# EAGLE design Grove - Buzzer v1.1b (EAGLE 6.3)
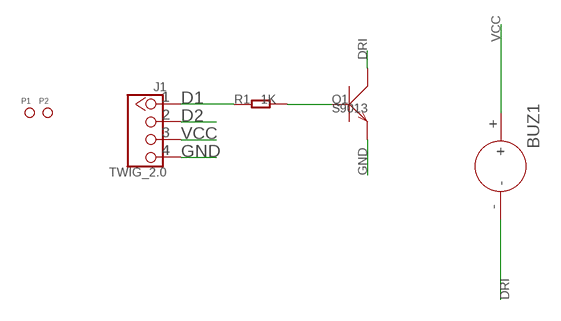
[diagram p0: schematic, sheet 1]

## Parts
BUZ1  BUZZER-YMD12065  [2P-7.6-D12X6.5H]
J1  TWIG_2.0  [2.0_1X4]
P1  PAD-MARK  [ROUND-MARK-1.0]
P2  PAD-MARK  [ROUND-MARK-1.0]
Q1  S9013  TRANSISTOR-NPN-SOT23  [SOT23]
R1  1K  R-0603  [R0603]

## Nets
D1: J1.1 R1.1
D2: J1.2
DRI: BUZ1.- Q1.3(C)
GND: J1.4 Q1.2(E)
N$2: Q1.1(B) R1.2
VCC: BUZ1.+ J1.3

## Library data of the parts
BUZ1 = Discrete:BUZZER
J1 = CONNECTER:TWIG_2.0
P1 P2 = Discrete:PAD-MARK; PARTNO: DNP
Q1 = Discrete:TRANSISTOR-NPN*: NPN audion
R1 = Discrete:R*

## Board
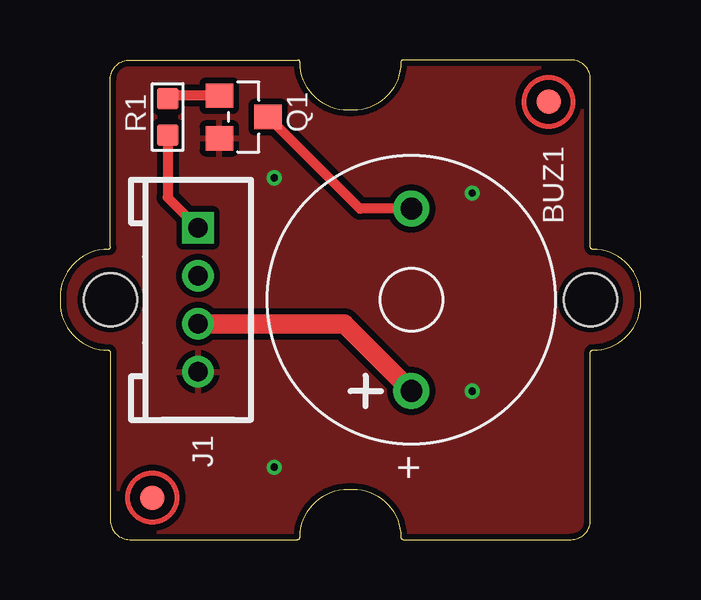
[diagram p1: board, top side]
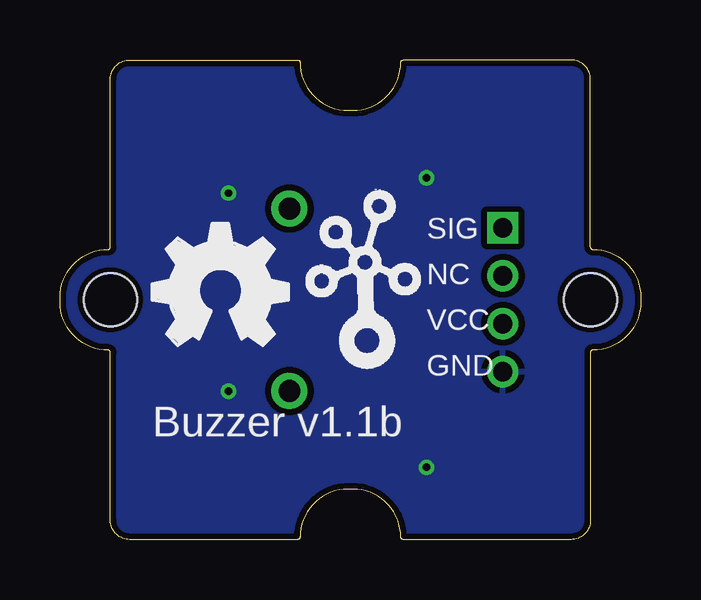
[diagram p2: board, bottom side, seen from below]

Size 24.2 x 20 mm. Coordinates in mm from the lower left corner, seen from the top.
Copper layers (1*16): Top 0.035mm / dielectric 1.5mm / Bottom 0.035mm
Design rules "SeeedStudio_rule_no_angle_090911": minimum track width 6mil, minimum drill 12mil, track to track 6mil, track to pad 6mil, pad to pad 6mil, via to via 6mil, smd to smd 0mil, copper to edge 10mil, drill to drill 10mil, minimum pad ring 10mil, minimum via ring 6mil, stop-mask expansion 2mil, vias tented up to drill 25mil, thermal gap 10mil

### Footprints (pad centres in the part's own frame; a part is rotated, then mirrored left to right if it is on the bottom)
2P-7.6-D12X6.5H = drill 0.9 pad 1.5: + -3.8,0; - 3.8,0
2.0_1X4 = drill 0.8 pad 1.27 square: 1 -3,0 | drill 0.8 pad 1.27: 2 -1,0; 3 1,0; 4 3,0
ROUND-MARK-1.0 = smd 1.016 x 1.016: P$1 0,0
SOT23 = smd 1.016 x 1.143: 1 -0.889,-1.016; 2 0.889,-1.016; 3 0,1.016
R0603 = smd 0.889 x 0.889: 1 -0.762,0; 2 0.762,0
1U-DIM-W/-DRILL = hole 2.2: 0,-10; 0,10

### Placement (x,y rotation side)
BUZ1  14.64,10 90 top
J1  5.75,10 270 top
P1  20.36,18.26 0 top
P2  3.84,1.74 0 top
Q1  7.65,17.62 270 top
R1  4.48,17.62 90 top
U$1  [1U-DIM-W/-DRILL]  12.1,10 90 top
U$2  [OSHW_FILLX200_NOTEXT]  20.36,8.1 0 bottom
U$3  [TWIGLOGO]  11.46,8.1 0 bottom

### Tracks (layer width: path | path; a pad name or v marks a point on that pad's centre or on a via)
D1
  Top 0.406: R1.1 4.48,14.27 J1.1
DRI
  Top 0.406: BUZ1.- 12.49,13.8 Q1.3
GND  (via drill 0.3 pad 0.64)
  other vias: 17.18,14.45 17.18,6.19 8.93,15.08 8.93,3.01
  pour Top (isolate 0.254): -0.6,-0.16 24.8,-0.16 24.8,20.16 -0.6,20.16 -0.6,-0.03
  pour Bottom (isolate 0.254): -0.6,-0.16 24.8,-0.16 24.8,20.16 -0.6,20.16 -0.6,-0.03
N$2
  Top 0.406: Q1.1 4.48,18.51 R1.2
VCC
  Top 0.813: J1.3 11.84,9 BUZ1.+

### Text on the board
tPlace: +
bPlace: SIG | NC | VCC | GND | Buzzer v1.1b